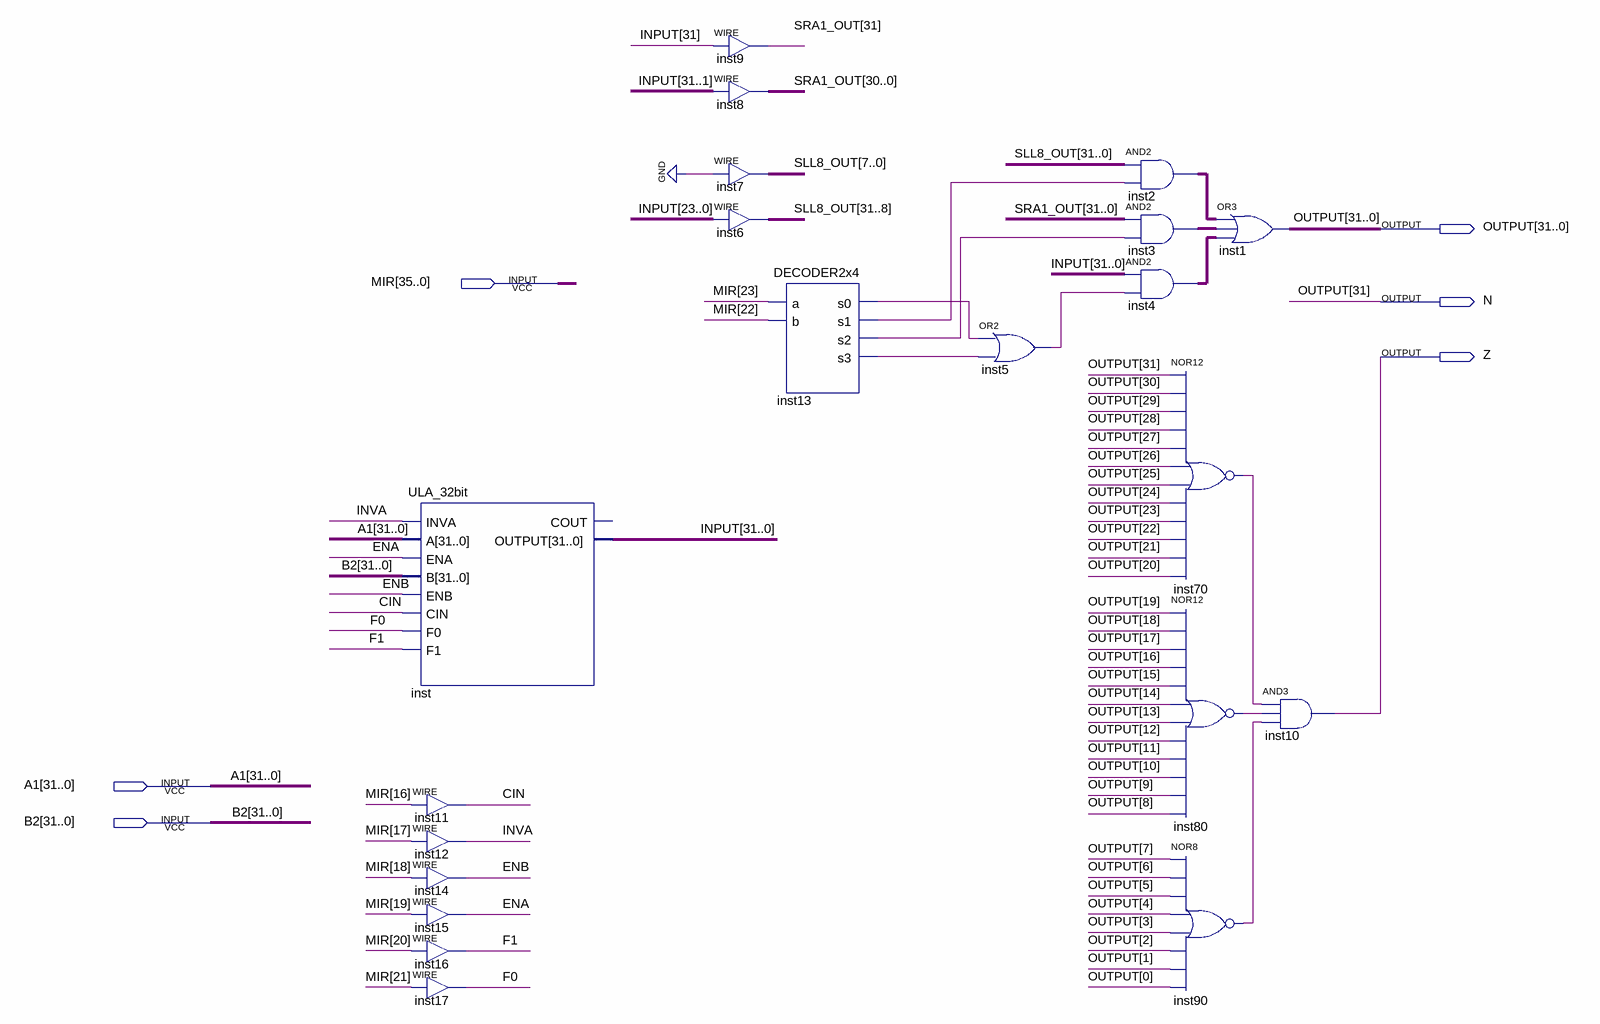
[diagram p0: schematic sheet]
// Quartus schematic SHIFTER_ULA.bdf as structural Verilog: 21 symbols, 6 pins
module SHIFTER_ULA (
  input  [35:0] MIR,
  input  [31:0] A1,
  input  [31:0] B2,
  output [31:0] OUTPUT,
  output N,
  output Z
);

  wire CIN, ENA, ENB, F0, F1, inst5_out, inst13_s0, inst13_s1, inst13_s2, inst13_s3, inst70_out, inst80_out,
       inst90_out, INVA;
  wire [31:0] INPUT, inst2_out, inst3_out, inst4_out, SLL8_OUT, SRA1_OUT;

  ULA_32bit inst (
    .INVA(INVA), .A(A1), .ENA(ENA), .B(B2), .ENB(ENB), .CIN(CIN), .F0(F0), .F1(F1), .OUTPUT(INPUT));  // open: COUT
  assign CIN = MIR[16];  // WIRE inst11
  assign INVA = MIR[17];  // WIRE inst12
  assign ENB = MIR[18];  // WIRE inst14
  assign ENA = MIR[19];  // WIRE inst15
  assign F1 = MIR[20];  // WIRE inst16
  assign F0 = MIR[21];  // WIRE inst17
  assign SRA1_OUT[31] = INPUT[31];  // WIRE inst9
  assign SRA1_OUT[30:0] = INPUT[31:1];  // WIRE inst8
  assign SLL8_OUT[7:0] = {8{1'b0}};  // WIRE inst7
  assign SLL8_OUT[31:8] = INPUT[23:0];  // WIRE inst6
  DECODER2x4 inst13 (.a(MIR[23]), .b(MIR[22]), .s0(inst13_s0), .s1(inst13_s1), .s2(inst13_s2), .s3(inst13_s3));
  or inst5 (inst5_out, inst13_s0, inst13_s3);
  assign inst2_out = SLL8_OUT & {32{inst13_s1}};  // AND2 inst2, 32 bits wide
  assign inst3_out = SRA1_OUT & {32{inst13_s2}};  // AND2 inst3, 32 bits wide
  assign inst4_out = INPUT & {32{inst5_out}};  // AND2 inst4, 32 bits wide
  nor inst70 (inst70_out, N, OUTPUT[30], OUTPUT[29], OUTPUT[28], OUTPUT[27], OUTPUT[26], OUTPUT[25], OUTPUT[24], OUTPUT[23], OUTPUT[22], OUTPUT[21], OUTPUT[20]);
  nor inst80 (inst80_out, OUTPUT[19], OUTPUT[18], OUTPUT[17], OUTPUT[16], OUTPUT[15], OUTPUT[14], OUTPUT[13], OUTPUT[12], OUTPUT[11], OUTPUT[10], OUTPUT[9], OUTPUT[8]);
  nor inst90 (inst90_out, OUTPUT[7], OUTPUT[6], OUTPUT[5], OUTPUT[4], OUTPUT[3], OUTPUT[2], OUTPUT[1], OUTPUT[0]);
  assign {N, OUTPUT[30:0]} = inst2_out | inst3_out | inst4_out;  // OR3 inst1, 32 bits wide
  and inst10 (Z, inst70_out, inst80_out, inst90_out);

  assign OUTPUT[31] = N;
endmodule
